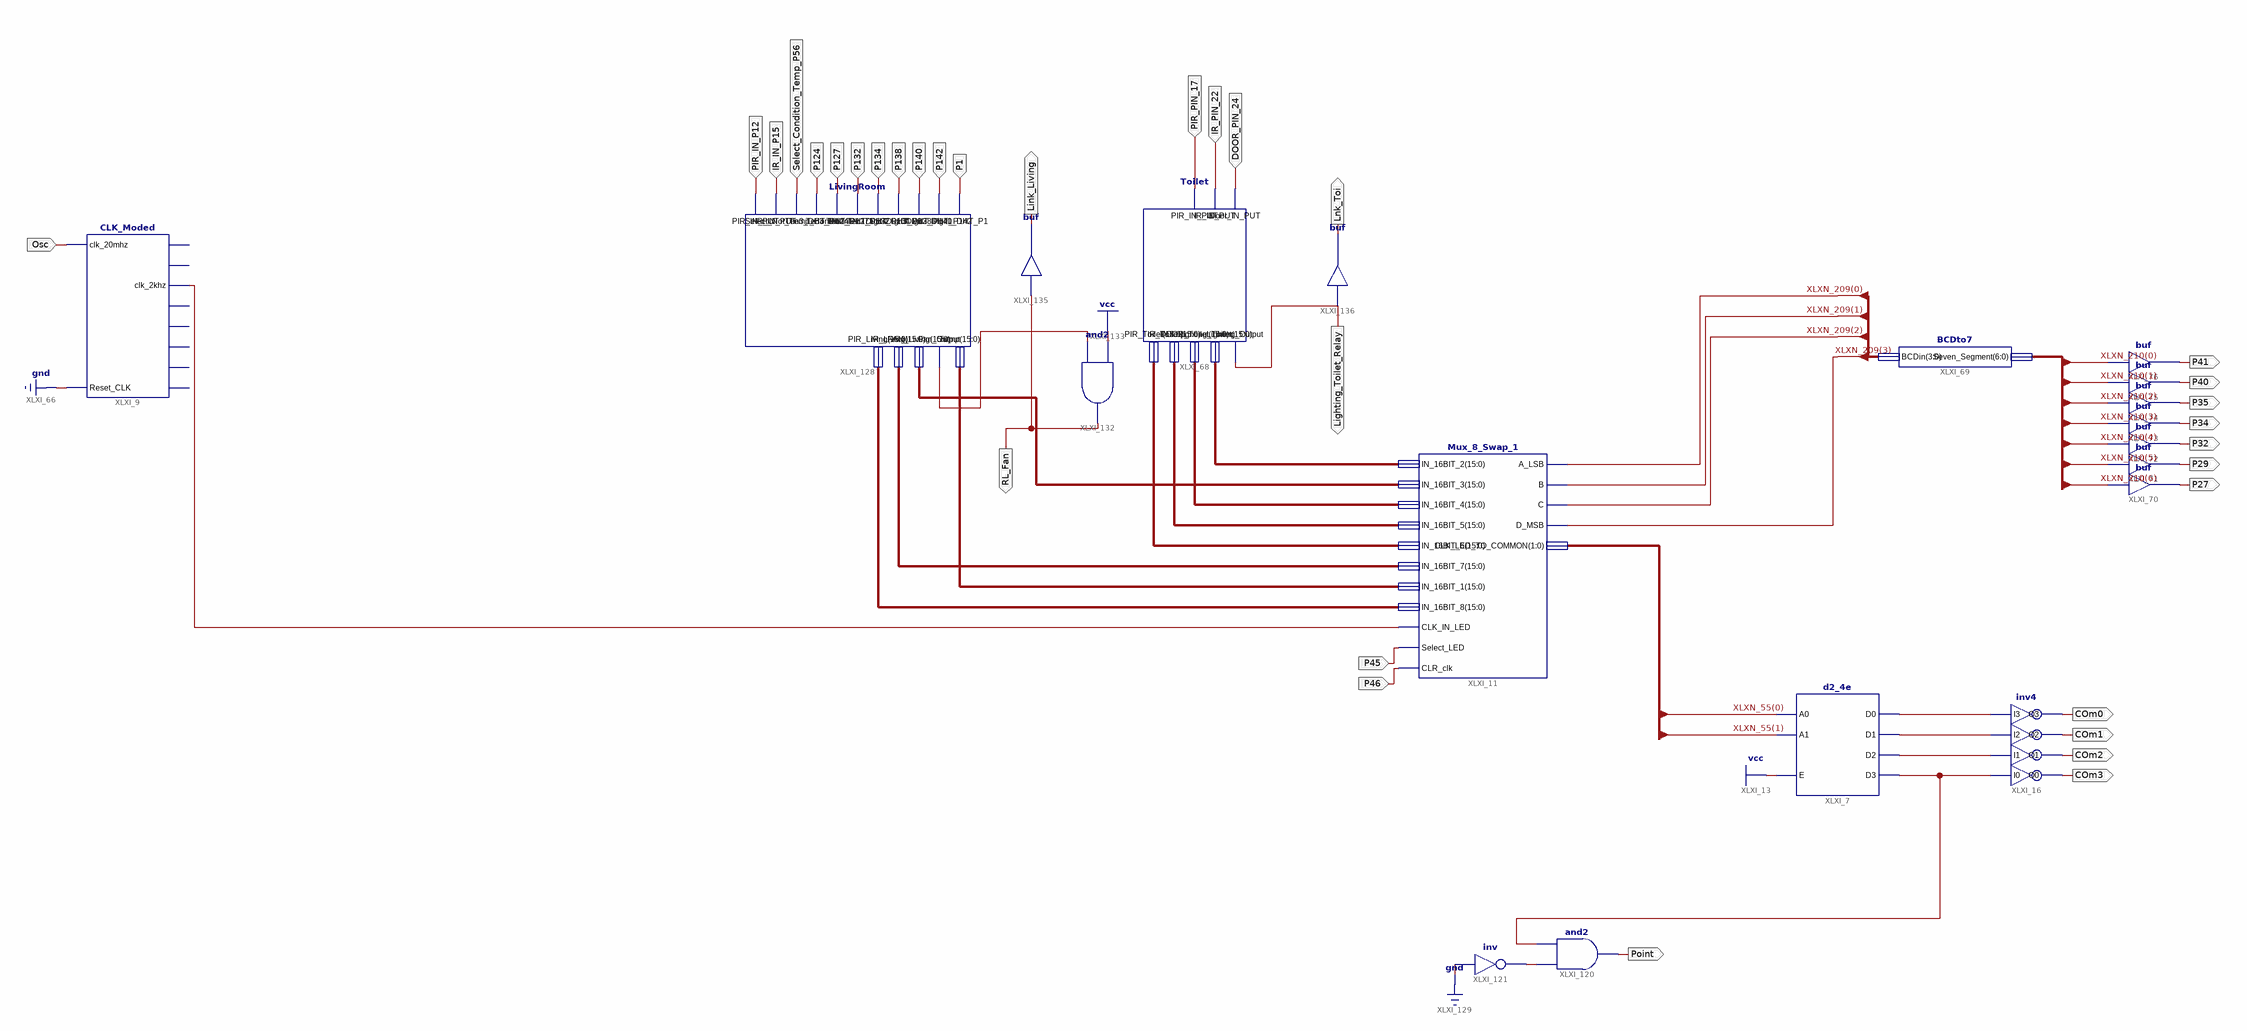
[diagram p0: schematic sheet 1]
// Xilinx ISE schematic Main_Module.sch (spartan6) as structural Verilog: 19 symbols, 33 ports
module Main_Module (
  input  Osc,
  input  P45,
  input  P46,
  input  PIR_PIN_17,
  input  IR_PIN_22,
  input  DOOR_PIN_24,
  input  P1,
  input  P142,
  input  P140,
  input  P138,
  input  P134,
  input  P132,
  input  P127,
  input  P124,
  input  Select_Condition_Temp_P56,
  input  IR_IN_P15,
  input  PIR_IN_P12,
  output COm0,
  output COm1,
  output COm2,
  output P27,
  output P29,
  output P32,
  output P34,
  output P35,
  output P40,
  output P41,
  output COm3,
  output Point,
  output Lighting_Toilet_Relay,
  output RL_Fan,
  output Link_Living,
  output Lnk_Toi
);

  wire XLXN_90, XLXN_91, XLXN_98, XLXN_299, XLXN_300, XLXN_306, XLXN_334;
  wire [1:0] XLXN_55;
  wire [3:0] XLXN_209;
  wire [6:0] XLXN_210;
  wire [15:0] XLXN_188, XLXN_189, XLXN_190, XLXN_191, XLXN_316, XLXN_317, XLXN_318, XLXN_319;

  d2_4e XLXI_7 (.A0(XLXN_55[0]), .A1(XLXN_55[1]), .E(1'b1), .D0(XLXN_90), .D1(XLXN_91), .D2(XLXN_299), .D3(XLXN_306));
  Mux_8_Swap_1 XLXI_11 (
    .A_LSB(XLXN_209[0]), .B(XLXN_209[1]), .C(XLXN_209[2]), .CLK_IN_LED(XLXN_98), .CLK_LED_TO_COMMON(XLXN_55),
    .CLR_clk(P46), .D_MSB(XLXN_209[3]), .IN_16BIT_1(XLXN_316), .IN_16BIT_2(XLXN_188), .IN_16BIT_3(XLXN_317),
    .IN_16BIT_4(XLXN_189), .IN_16BIT_5(XLXN_190), .IN_16BIT_6(XLXN_191), .IN_16BIT_7(XLXN_318),
    .IN_16BIT_8(XLXN_319), .Select_LED(P45));
  inv4 XLXI_16 (.I0(XLXN_306), .I1(XLXN_299), .I2(XLXN_91), .I3(XLXN_90), .O0(COm3), .O1(COm2), .O2(COm1), .O3(COm0));
  CLK_Moded XLXI_9 (
    .clk_20mhz(Osc), .Reset_CLK(1'b0), .clk_2khz(XLXN_98));  // open: clk_2mhz, clk_200khz, clk_200hz, clk_2hz, clk_20khz, clk_20hz, clk_1hz
  Toilet XLXI_68 (
    .Door_IN_PUT(DOOR_PIN_24), .DOOR_Toilet(XLXN_189), .IR_IN_PUT(IR_PIN_22), .IR_Toilet(XLXN_190),
    .Lighting_Output(Lighting_Toilet_Relay), .Lighting_Toilet(XLXN_188), .PIR_IN_PUT(PIR_PIN_17),
    .PIR_Toilet(XLXN_191));
  BCDto7 XLXI_69 (.BCDin(XLXN_209), .Seven_Segment(XLXN_210));
  buf XLXI_70 (P27, XLXN_210[6]);
  buf XLXI_71 (P29, XLXN_210[5]);
  buf XLXI_72 (P32, XLXN_210[4]);
  buf XLXI_73 (P34, XLXN_210[3]);
  buf XLXI_74 (P35, XLXN_210[2]);
  buf XLXI_75 (P40, XLXN_210[1]);
  buf XLXI_76 (P41, XLXN_210[0]);
  and XLXI_120 (Point, XLXN_300, XLXN_306);
  not XLXI_121 (XLXN_300, 1'b0);
  LivingRoom XLXI_128 (
    .Digit1_DHT_P1(P1), .Digit2_DHT_P142(P142), .Digit3_DHT_P140(P140), .Digit4_DHT_P138(P138),
    .FAN_Living(XLXN_317), .Fan_Output(XLXN_334), .IR_IN_PUT(IR_IN_P15), .IR_Living(XLXN_318),
    .PIR_IN_PUT(PIR_IN_P12), .PIR_Living(XLXN_319), .Select_Not_Temp_Condition(Select_Condition_Temp_P56),
    .Temp(XLXN_316), .Ten1_DHT_P134(P134), .Ten2_DHT_P132(P132), .Ten3_DHT_P124(P124), .Ten3_DHT_P127(P127));
  and XLXI_132 (RL_Fan, XLXN_334, 1'b1);
  buf XLXI_135 (Link_Living, RL_Fan);
  buf XLXI_136 (Lnk_Toi, Lighting_Toilet_Relay);
endmodule
